# EAGLE design ELEKTRA-PMIC v0.2-Half frame shield for astellated edges adjacent-35X22.86-0.8 (EAGLE 9.6.2)

## Sheet 1 of 2
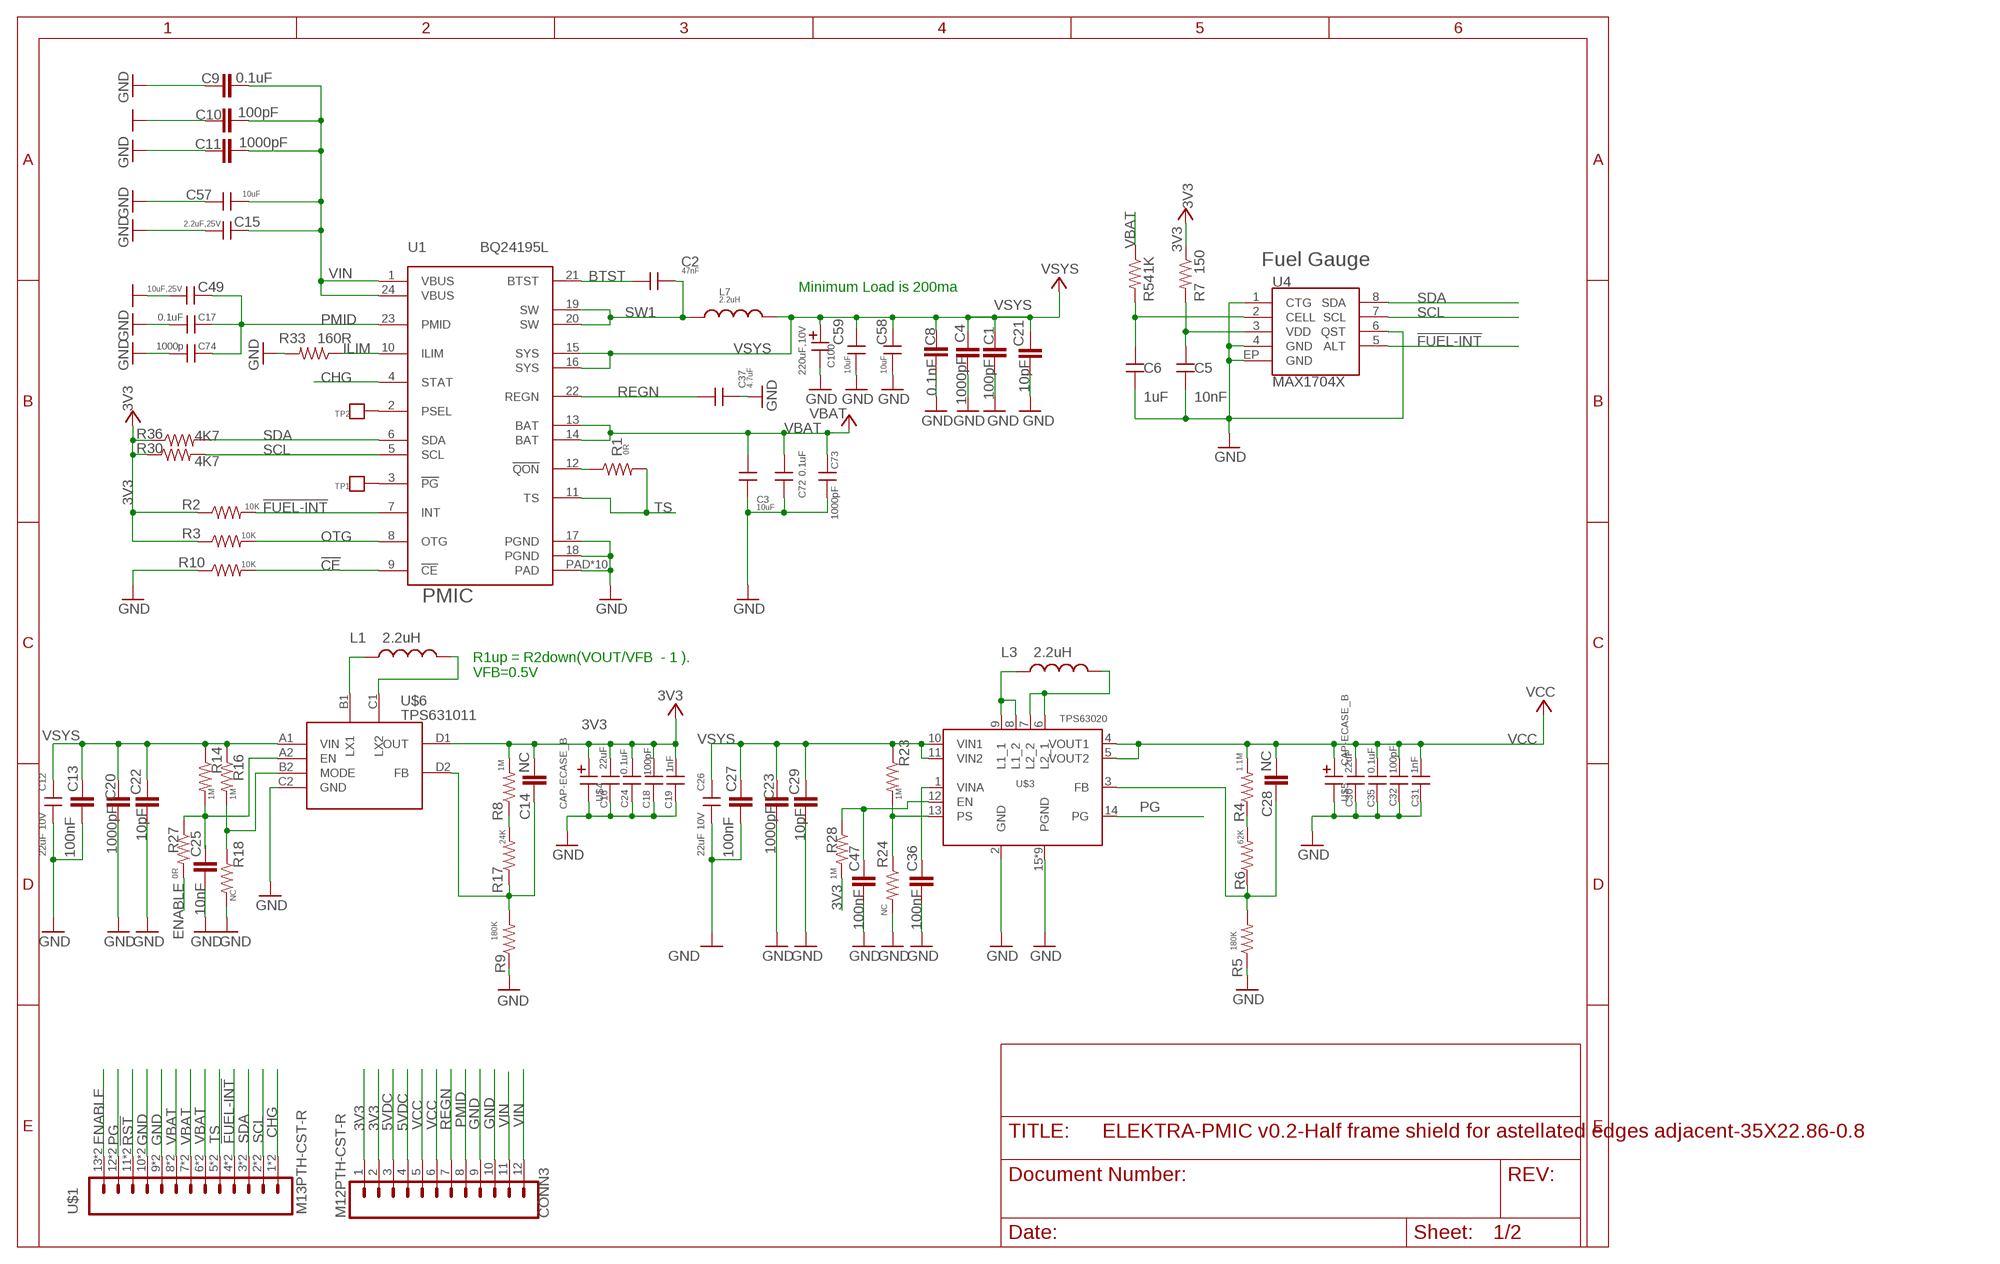
[diagram p0: schematic, sheet 1]

### Parts
C1  100pF  CAP_1  [C0402_B]
C2  47nF  CAP0402  [C-0402]
C3  10uF  CAPC0603  [C0603]
C4  1000pF  CAP_1  [C0402_B]
C5  10nF  CAP0402A  [C0402]
C6  1uF  CAP0402A  [C0402]
C8  0.1nF  CAP_1  [C0402_B]
C9  0.1uF  CAP_1  [C0402_B]
C10  100pF  CAP_1  [C0402_B]
C11  1000pF  CAP_1  [C0402_B]
C12  22uF 10V  CAPC0805  [C0805]
C13  100nF  CAP_1  [C0402_B]
C14  NC  CAP_1  [C0402_B]
C15  2.2uF,25V  CAP0603A  [C-0603A]
C16  22uF  CAP0603A  [C-0603A]
C17  0.1uF  CAP0402A  [C0402]
C18  100pF  CAP0402A  [C0402]
C19  1nF  CAP0402A  [C0402]
C20  1000pF  CAP_1  [C0402_B]
C21  10pF  CAP_1  [C0402_B]
C22  10pF  CAP_1  [C0402_B]
C23  1000pF  CAP_1  [C0402_B]
C24  0.1uF  CAP0402A  [C0402]
C25  10nF  CAP_1  [C0402_B]
C26  22uF 10V  CAPC0805  [C0805]
C27  100nF  CAP_1  [C0402_B]
C28  NC  CAP_1  [C0402_B]
C29  10pF  CAP_1  [C0402_B]
C30  22uF  CAP0603A  [C-0603A]
C31  1nF  CAP0402A  [C0402]
C32  100pF  CAP0402A  [C0402]
C35  0.1uF  CAP0402A  [C0402]
C36  100nF  CAP_1  [C0402_B]
C37  4.7uF  CAP0402A  [C0402]
C47  100nF  CAP_1  [C0402_B]
C49  10uF,25V  CAP0603A  [C-0603A]
C57  10uF  CAP0603A  [C-0603A]
C58  10uF  CAP0603A  [C-0603A]
C59  10uF  CAP0603A  [C-0603A]
C72  0.1uF  CAP0402  [C-0402]
C73  1000pF  CAP0402  [C-0402]
C74  1000p  CAP0402  [C-0402]
C100  220uF,10V  CAP-ECASE_B  [CASE-B]
CONN3  M12PTH-CST-R  [1X12-CASTELLATED]
L1  2.2uH  INDUCTOR-SPARKFUNVLS3012ET-4R7M  [INDUCTOR-VLS-E]
L3  2.2uH  INDUCTOR-SPARKFUNVLS3012ET-4R7M  [INDUCTOR-VLS-E]
L7  2.2uH  INDUCTORI  [INDUCTOR-4040]
R1  0R  R-US_  [R0402_B]
R2  10K  R-US_  [R0402_B]
R3  10K  R-US_  [R0402_B]
R4  1.1M  R-US_  [R0402_B]
R5  180K  R-US_  [R0402_B]
R6  62K  R-US_  [R0402_B]
R7  150  R-US_  [R0402_B]
R8  1M  R-US_  [R0402_B]
R9  180K  R-US_  [R0402_B]
R10  10K  R-US_  [R0402_B]
R14  1M  R-US_  [R0402_B]
R16  1M  R-US_  [R0402_B]
R17  24K  R-US_  [R0402_B]
R18  NC  R-US_  [R0402_B]
R23  1M  R-US_  [R0402_B]
R24  NC  R-US_  [R0402_B]
R27  0R  R-US_  [R0402_B]
R28  1M  R-US_  [R0402_B]
R30  4K7  R-US_  [R0402_B]
R33  160R  R-US_  [R0402_B]
R36  4K7  R-US_  [R0402_B]
R54  1K  R-US_  [R0402_B]
TP1  TP  [TP0.7MM]
TP2  TP  [TP0.7MM]
U1  BQ24195L  BQ24298RTWR  [QFN24]
U4  MAX1704X  [TDFN-8]
U$1  M13PTH-CST-R  [1X13-CASTELLATED]
U$3  TPS63020  [TPS63020]
U$4  CAP-ECASE_B  [CASE-B]
U$5  CAP-ECASE_B  [CASE-B]
U$6  TPS631011  TPS631010  [DSBGA]

### Nets
3V3: C14.2 C16.1 C18.1 C19.1 C24.1 CONN3.1 CONN3.2 R2.1 R3.1 R7.1 R8.2 R28.2 R30.1 R36.1 U$4.P$1 U$6.D1(OUT)
5VDC: CONN3.3 CONN3.4
!CE: R10.2 U1.9(!CE)
!FUEL-INT: R2.2 U1.7(INT) U4.5(ALT) U$1.4 U$1.@4
!RST: U$1.11 U$1.@11
BTST: C2.1 U1.21(BTST)
CHG: U1.4(STAT) U$1.1 U$1.@1
ENABLE: R27.2 U$1.13 U$1.@13
GND: C1.1 C3.2 C4.1 C5.2 C6.2 C8.1 C9.1 C10.1 C11.1 C12.2 C13.1 C15.2 C16.2 C17.1 C18.2 C19.2 C20.1 C21.1 C22.1 C23.1 C24.2 C25.1 C26.2 C27.1 C29.1 C30.2 C31.2 C32.2 C35.2 C36.1 C37.2 C47.1 C49.2 C57.2 C58.2 C59.2 C72.2 C73.2 C74.1 C100.P$2 CONN3.9 CONN3.10 R5.1 R9.1 R10.1 R18.2 R24.2 R33.2 U1.17(PGND) U1.18(PGND) U1.PAD U1.PAD@1(PAD) U1.PAD@2(PAD) U1.PAD@3(PAD) U1.PAD@4(PAD) U1.PAD@5(PAD) U1.PAD@6(PAD) U1.PAD@7(PAD) U1.PAD@8(PAD) U1.PAD@9(PAD) U4.1(CTG) U4.4(GND) U4.6(QST) U4.EP(GND) U$1.9 U$1.10 U$1.@9 U$1.@10 U$3.2(GND) U$3.15(PGND) U$3.16(PGND) U$3.17(PGND) U$3.18(PGND) U$3.19(PGND) U$3.20(PGND) U$3.21(PGND) U$3.22(PGND) U$3.23(PGND) U$4.P$2 U$5.P$2 U$6.C2(GND)
ILIM: R33.1 U1.10(ILIM)
N$1: R1.1 U1.12(!QON)
N$4: TP1.P$1 U1.3(!PG)
N$5: C14.1 R9.2 R17.1 U$6.D2(FB)
N$6: C28.1 R5.2 R6.1 U$3.3(FB)
N$7: TP2.P$1 U1.2(PSEL)
N$8: R8.1 R17.2
N$9: R4.1 R6.2
N$11: L3.P$1 U$3.8(L1_2) U$3.9(L1_1)
N$12: L1.P$1 U$6.B1(LX1)
N$14: C25.2 R14.2 R27.1 U$6.A2(EN)
N$15: R16.2 R18.1 U$6.B2(MODE)
N$16: L3.P$2 U$3.6(L2_1) U$3.7(L2_2)
N$17: L1.P$2 U$6.C1(LX2)
N$19: C36.2 U$3.1(VINA)
N$21: C47.2 R28.1 U$3.12(EN)
N$22: R23.2 R24.1 U$3.13(PS)
N$48: C5.1 R7.2 U4.3(VDD)
N$49: C6.1 R54.2 U4.2(CELL)
OTG: R3.2 U1.8(OTG)
PG: U$1.12 U$1.@12 U$3.14(PG)
PMID: C17.2 C49.1 C74.2 CONN3.8 U1.23(PMID)
REGN: C37.1 CONN3.7 U1.22(REGN)
SCL: R30.2 U1.5(SCL) U4.7(SCL) U$1.2 U$1.@2
SDA: R36.2 U1.6(SDA) U4.8(SDA) U$1.3 U$1.@3
SW1: C2.2 L7.P$1 U1.19(SW) U1.20(SW)
TS: R1.2 U1.11(TS) U$1.5 U$1.@5
VBAT: C3.1 C72.1 C73.1 R54.1 U1.13(BAT) U1.14(BAT) U$1.6 U$1.7 U$1.8 U$1.@6 U$1.@7 U$1.@8
VCC: C28.2 C30.1 C31.1 C32.1 C35.1 CONN3.5 CONN3.6 R4.2 U$3.4(VOUT1) U$3.5(VOUT2) U$5.P$1
VIN: C9.2 C10.2 C11.2 C15.1 C57.1 CONN3.11 CONN3.12 U1.1(VBUS) U1.24(VBUS)
VSYS: C1.2 C4.2 C8.2 C12.1 C13.2 C20.2 C21.2 C22.2 C23.2 C26.1 C27.2 C29.2 C58.1 C59.1 C100.P$1 L7.P$2 R14.1 R16.1 R23.1 U1.15(SYS) U1.16(SYS) U$3.10(VIN1) U$3.11(VIN2) U$6.A1(VIN)

### Notes on the sheet
- Fuel Gauge
- Minimum Load is 200ma
- PMIC
- R1up = R2down(VOUT/VFB  - 1 ).
  VFB=0.5V

## Sheet 2 of 2

## Library data of the parts
C1 = Particle:CAP_1; ITEM_NAME: CAP CER 100pF 50V X7R 0402 10%; ITEM_NUMBER: PT-200138
C2 = particle SZ:CAP: CAP; ITEM_NAME: CAP CER 0.1uF 16V X7R 0402 10%; ITEM_NUMBER: PT-200005
C3 C37 C58 C59 = particle SZ:CAP: CAP; ITEM_NAME: CAP CER 10uF 6.3V X5R 0603 10% Low ESR<70mohms; ITEM_NUMBER: PT-200209
C4 C20 C23 = Particle:CAP_1; ITEM_NAME: CAP CER 1000PF 50V X7R 0402 10%
C5 = particle SZ:CAP: CAP; ITEM_NAME: CAP CER 10nF 16V X5R 0402 10%; ITEM_NUMBER: PT-200136
C6 = particle SZ:CAP: CAP; ITEM_NAME: CAP CER X5R 1uF 0402 10V ±10% ROHS; ITEM_NUMBER: PT-200695
C8 C13 C27 = Particle:CAP_1; ITEM_NAME: CAP CER 0.1UF 16V X7R 0402 10%; ITEM_NUMBER: PT-200649
C9 = Particle:CAP_1; ITEM_NAME: CAP CER 0.1UF 25V X7R 0402 20%; ITEM_NUMBER: PT-200690
C10 = Particle:CAP_1; ITEM_NAME: CAP CER 100PF 1% 50V C0G/NP0 0402; ITEM_NUMBER: 120-00051
C11 = Particle:CAP_1; ITEM_NAME: CAP CER 1000PF 50V X7R 0402 10%; ITEM_NUMBER: PT-200631
C12 C26 = particle SZ:CAP: CAP; ITEM_NAME: CAP CER 0.1UF 16V X7R 0402 10%; ITEM_NUMBER: 120-00060
C14 C25 C28 C36 C47 = Particle:CAP_1
C15 C49 C57 = particle SZ:CAP: CAP; ITEM_NAME: CAP CER 100PF 50V C0G/NP0 0603 5%; ITEM_NUMBER: PT-200458
C16 C30 = particle SZ:CAP: CAP; ITEM_NAME: CAP CER 22UF 10V X5R 0603 20%; ITEM_NUMBER: 120-00061
C17 = RedBear:CAP: CAP; ITEM_NAME: CAP CER 0.1UF 25V X7R 0402 20%; ITEM_NUMBER: PT-200690
C18 C32 = particle SZ:CAP: CAP; ITEM_NAME: 100pF 50V X7R 0402 10%; ITEM_NUMBER: PT-200138
C19 C31 C73 = particle SZ:CAP: CAP; ITEM_NAME: 1000PF 50V X7R 0402 10%; ITEM_NUMBER: PT-200631
C21 C22 C29 = Particle:CAP_1; ITEM_NAME: CAP CER 10PF 5% 50V C0G/NP0 0402; ITEM_NUMBER: 120-00038
C24 C35 = particle SZ:CAP: CAP; ITEM_NAME: 0.1UF 16V X7R 0402 10%; ITEM_NUMBER: PT-200649
C72 = particle SZ:CAP: CAP; ITEM_NAME: CAP CER 0.1UF 16V X7R 0402 10%; ITEM_NUMBER: PT-200649
C74 = particle SZ:CAP: CAP; ITEM_NAME: CAP CER 1000PF 50V X7R 0402 10%; ITEM_NUMBER: PT-200631
C100 U$4 U$5 = particle SZ:CAP-E
CONN3 = Particle:M12: Header 12 Standard 12-pin 0.1" header. Use with straight break away headers (SKU : PRT-00116), right angle break away headers (PRT-00553), swiss pins (PRT-00743), machine pins (PRT-00117), and female headers (PRT-00115).
L1 L3 = Particle:INDUCTOR-SPARKFUN: Inductors Basic Inductor/Choke - 0603 and 1206. Footprints are not proven and vary greatly between part numbers. SRN6045- 33uH, 20% 1.4A
L7 = Particle:INDUCTOR; ITEM_NAME: FIXED IND 1UH 5.8A 26 MOHM SMD 4020; ITEM_NUMBER: 155-00005
R1 = Spark:R-US_: 0402 Resistor; ITEM_NAME: RES SMD 0R OHM 5% 1/16W 0402; ITEM_NUMBER: PT-200624
R2 R3 R10 = Spark:R-US_: 0402 Resistor; ITEM_NAME: 10K OHM 5% 1/16W 0402; ITEM_NUMBER: PT-200004
R4-R6 R9 R18 R24 R27 R28 = Spark:R-US_: 0402 Resistor
R7 R33 = Particle:R-US_: 0402 Resistor
R8 R14 R16 R23 = Spark:R-US_: 0402 Resistor; ITEM_NAME: RES SMD 1M OHM 1% 1/16W 0402; ITEM_NUMBER: PT-201084
R17 = Spark:R-US_: 0402 Resistor; ITEM_NAME: RES SMD 24K OHM 1% 1/16W 0402; ITEM_NUMBER: PT-201025
R30 R36 = Particle:R-US_: 0402 Resistor; ITEM_NAME: RES SMD 4K7 OHM 5% 1/16W 0402; ITEM_NUMBER: PT-200230
R54 = Particle:R-US_: 0402 Resistor; ITEM_NAME: RES SMD 1K OHM 5% 1/16W 0402; ITEM_NUMBER: PT-200002
TP1 TP2 = Asset Tracker SoM v1.0b:TP
U1 = electron:BQ24298RTWR: Bq24298 I2C Controlled 3A Single Cell USB Charger with Narrow VDC Power Path Management and Adjustable Voltage USB OTG; ITEM_NAME: IC BATT CHG LI-ION 1CELL 24VQFN 2.5A CHG CURRENT; ITEM_NUMBER: 150-00013
U4 = SparkFun-PowerIC:MAX1704X: MAX17043/MAX17044: Battery Fuel Guage (43 is 1cell, 44 is 2cell); ITEM_NAME: IC 2-WIRE FG MODEL GAUGE LO BATT; ITEM_NUMBER: PT-200141
U$1 = Particle:M13PTH-CST-R
U$3 = particle SZ:TPS63020
U$6 = particle SZ:TPS631010

## Net classes
0 default: width 0.152 mm, drill 0.203 mm, clearance 0.152 mm
1 power: width 0.254 mm, drill 0.203 mm, clearance 0.203 mm
3 BAT: drill 0.203 mm, clearance 0.203 mm
4 3V3: width 0.305 mm, drill 0.203 mm, clearance 0.508 mm
6 +3V3: width 0.203 mm, drill 0.203 mm, clearance 0.152 mm

## Board
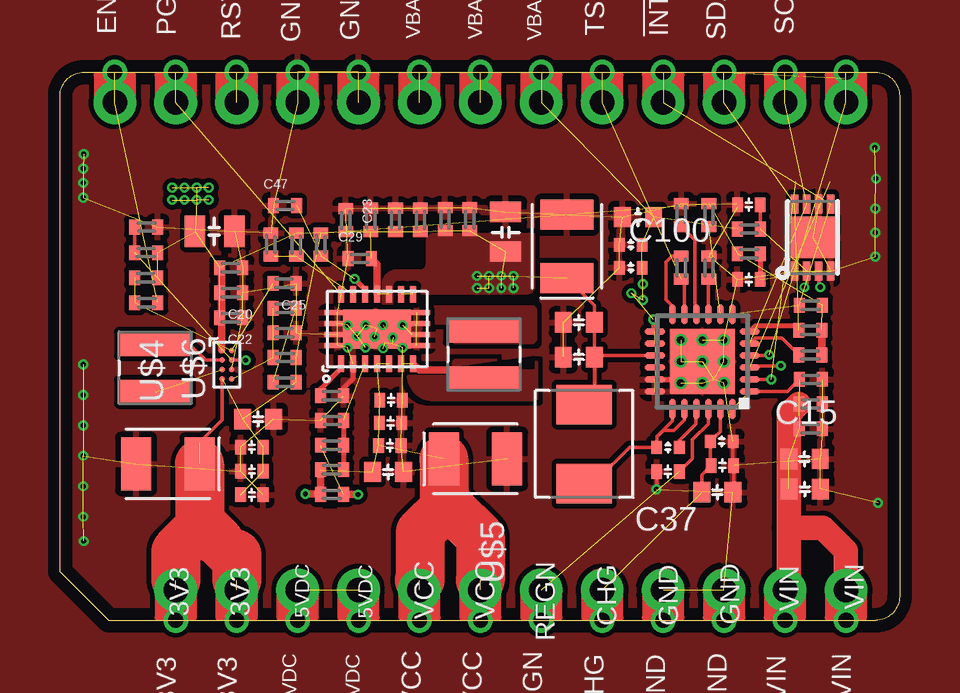
[diagram p1: board, top side]
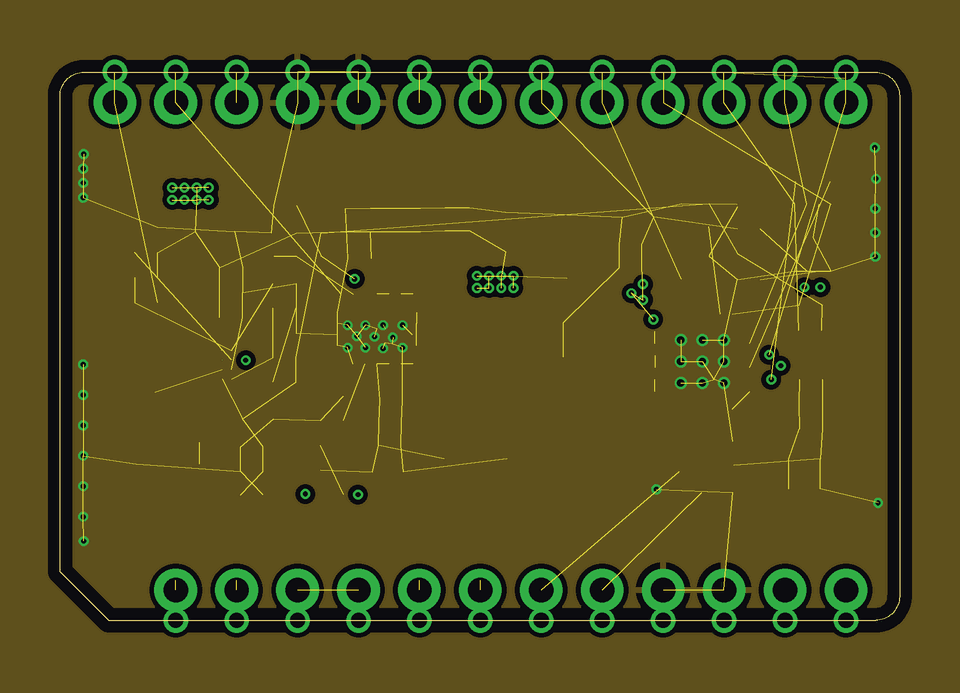
[diagram p2: board, inner layer Route2]
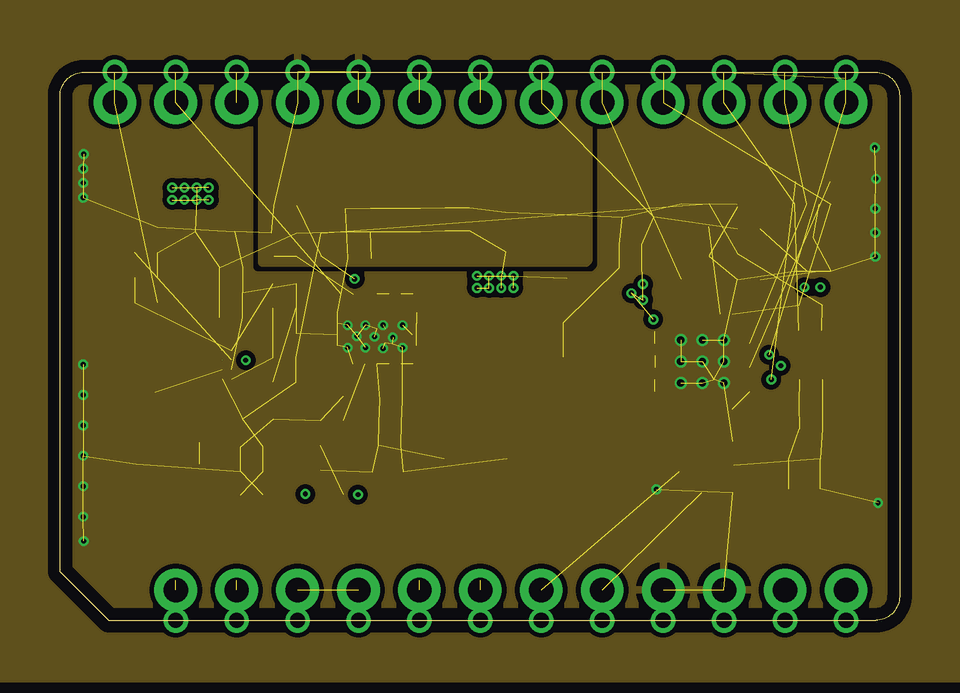
[diagram p3: board, inner layer Route15]
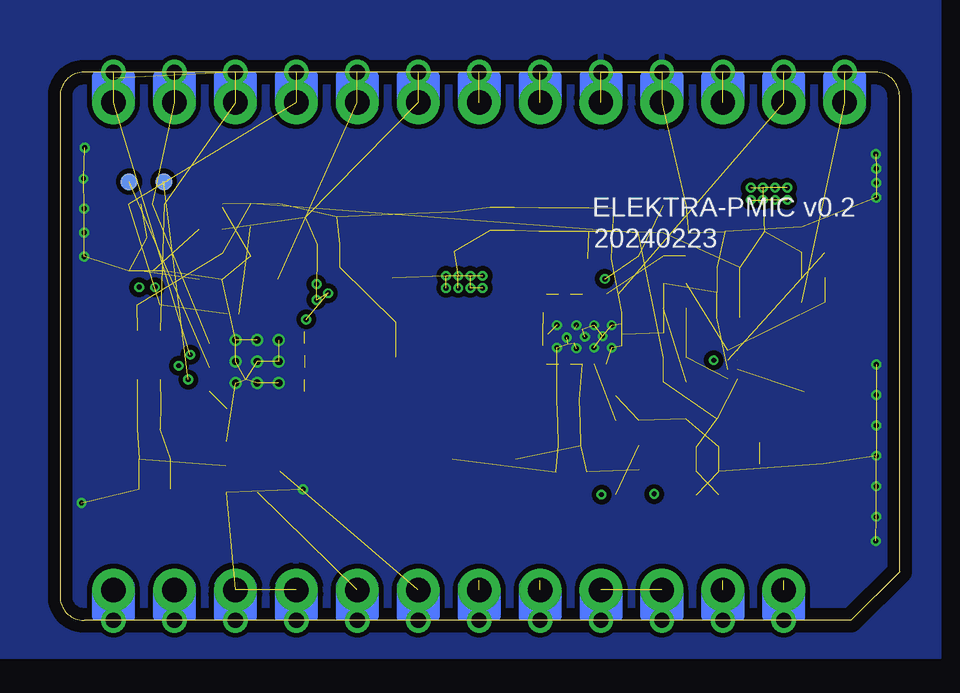
[diagram p4: board, bottom side, seen from below]

Size 35 x 22.86 mm. Coordinates in mm from the lower left corner, seen from the top.
Outline: 2.03,0 34,0 arc90 35,1 35,21.86 arc90 34,22.86 1,22.86 arc90 0,21.86 0,2.03 2.03,0
Copper layers (1+2*15+16): Top 0.035mm / dielectric 1.5mm / Route2 0.035mm / dielectric 0.15mm / Route15 0.035mm / dielectric 0.2mm / Bottom 0.035mm
Design rules "default *": minimum track width 4mil, minimum drill 8mil, track to track 8mil, track to pad 6mil, pad to pad 6mil, via to via 6mil, smd to smd 6mil, copper to edge 20mil, drill to drill 6mil, minimum pad ring 4mil, minimum via ring 4mil, stop-mask expansion 4mil, vias tented up to drill 16mil, thermal gap 10mil

### Footprints (pad centres in the part's own frame; a part is rotated, then mirrored left to right if it is on the bottom)
C0402_B = smd 0.457 x 0.61: 1 -0.483,0; 2 0.483,0
C-0402 = smd 0.45 x 0.55: 1 -0.47,0; 2 0.47,0
C0603 = smd 0.7 x 0.85: 1 -0.65,0; 2 0.65,0
C0402 = smd 0.45 x 0.6: 1 -0.47,0; 2 0.47,0
C0805 = smd 0.85 x 1.3: 1 -0.8,0; 2 0.85,0
C-0603A = smd 0.7 x 0.85: 1 -0.65,0; 2 0.65,0
CASE-B = smd 2.2 x 1.25: P$1 0,-1.32; P$2 0,1.32
1X12-CASTELLATED = drill 1.016 pad 1.778: 1 0,-13.97; 2 0,-11.43; 3 0,-8.89; 4 0,-6.35; 5 0,-3.81; 6 0,-1.27; 7 0,1.27; 8 0,3.81; 9 0,6.35; 10 0,8.89; 11 0,11.43; 12 0,13.97 | drill 0.635 pad 1.016: @1 1.27,-13.97; @2 1.27,-11.43; @3 1.27,-8.89; @4 1.27,-6.35; @5 1.27,-3.81; @6 1.27,-1.27; @7 1.27,1.27; @8 1.27,3.81; @9 1.27,6.35; @10 1.27,8.89; @11 1.27,11.43; @12 1.27,13.97
INDUCTOR-VLS-E = smd 1 x 3: P$1 -1,0; P$2 1,0
INDUCTOR-4040 = smd 1.65 x 2.3: P$1 -1.65,0; P$2 1.65,0
R0402_B = smd 0.457 x 0.61: 1 -0.483,0; 2 0.483,0
TP0.7MM = smd 0.7 x 0.7: P$1 0,0
QFN24 = smd 0.85 x 0.28: 1 -1.975,1.25; 2 -1.975,0.75; 3 -1.975,0.25; 4 -1.975,-0.25; 5 -1.975,-0.75; 6 -1.975,-1.25; 13 1.975,-1.25; 14 1.975,-0.75; 15 1.975,-0.25; 16 1.975,0.25; 17 1.975,0.75; 18 1.975,1.25 | smd 0.28 x 0.85: 7 -1.25,-1.975; 8 -0.75,-1.975; 9 -0.25,-1.975; 10 0.25,-1.975; 11 0.75,-1.975; 12 1.25,-1.975; 19 1.25,1.975; 20 0.75,1.975; 21 0.25,1.975; 22 -0.25,1.975; 23 -0.75,1.975; 24 -1.25,1.975 | smd 2.7 x 2.7: PAD 0,0 | drill 0.3 pad 0.406: PAD@1 -0.9,0.9; PAD@2 0,0.9; PAD@3 0.9,0.9; PAD@4 -0.9,0; PAD@5 0,0; PAD@6 0.9,0; PAD@7 -0.9,-0.9; PAD@8 0,-0.9; PAD@9 0.9,-0.9
TDFN-8 = smd 0.8 x 0.3: 1 -1.4,0.75; 2 -1.4,0.25; 3 -1.4,-0.25; 4 -1.4,-0.75; 5 1.4,-0.75; 6 1.4,-0.25; 7 1.4,0.25; 8 1.4,0.75 | smd 1.73 x 1.88: EP 0,0
1X13-CASTELLATED = drill 1.016 pad 1.778: 1 0,-15.24; 2 0,-12.7; 3 0,-10.16; 4 0,-7.62; 5 0,-5.08; 6 0,-2.54; 7 0,0; 8 0,2.54; 9 0,5.08; 10 0,7.62; 11 0,10.16; 12 0,12.7; 13 0,15.24 | drill 0.635 pad 1.016: @1 1.27,-15.24; @2 1.27,-12.7; @3 1.27,-10.16; @4 1.27,-7.62; @5 1.27,-5.08; @6 1.27,-2.54; @7 1.27,0; @8 1.27,2.54; @9 1.27,5.08; @10 1.27,7.62; @11 1.27,10.16; @12 1.27,12.7; @13 1.27,15.24
TPS63020 = smd 0.25 x 0.7: 1 -1.5,-1.45; 2 -1,-1.45; 3 -0.5,-1.45; 4 0,-1.45; 5 0.5,-1.45; 6 1,-1.45; 7 1.5,-1.45; 8 1.5,1.45; 9 1,1.45; 10 0.5,1.45; 11 0,1.45; 12 -0.5,1.45; 13 -1,1.45; 14 -1.5,1.45 | smd 1.1 x 0.2: 15 -1.65,0.69; 16 -1.65,0.23; 17 -1.65,-0.23; 18 -1.65,-0.69; 19 1.65,-0.69; 20 1.65,-0.23; 21 1.65,0.23; 22 1.65,0.69 | smd 2.85 x 1.58: 23 0,0
DSBGA = smd 0.23 x 0.23: A1 -0.2,0.6; A2 0.2,0.6; B1 -0.2,0.2; B2 0.2,0.2; C1 -0.2,-0.2; C2 0.2,-0.2; D1 -0.2,-0.6; D2 0.2,-0.6

### Placement (x,y rotation side)
C1  15.03,16.7 270 top
C2  25.35,7.21 180 top
C3  24.1,16.82 180 top
C4  16.06,16.73 270 top
C5  28.72,14.21 180 top
C6  28.72,17.33 180 top
C8  17.08,16.73 270 top
C9  31.3,7.99 180 top
C10  31.3,10.05 180 top
C11  31.29,9.03 180 top
C12  6.43,16.22 0 top
C13  7.14,14.7 180 top
C14  9.36,10.96 0 top
C15  31.04,6.73 0 top
C16  8.26,8.39 0 top
C17  27.61,6.46 180 top
C18  8,6.22 180 top
C19  8,7.23 180 top
C20  7.14,13.67 180 top
C21  13.99,16.7 270 top
C22  7.14,12.62 180 top
C23  11.91,16.69 270 top
C24  8,5.24 0 top
C25  9.36,14.05 180 top
C26  18.58,16.18 90 top
C27  12.95,16.7 270 top
C28  11.34,6.28 180 top
C29  12.5,15.09 0 top
C30  13.68,6.19 0 top
C31  13.8,9.18 0 top
C32  13.78,8.23 0 top
C35  13.75,7.29 0 top
C36  11.34,9.37 180 top
C37  25.35,6.2 180 top
C47  9.38,17.29 0 top
C49  27.41,5.35 0 top
C57  31.04,5.47 0 top
C58  21.63,10.98 180 top
C59  21.63,12.43 180 top
C72  23.8,14.7 180 top
C73  23.8,15.66 180 top
C74  27.59,7.47 180 top
C100  21.13,15.6 0 top
CONN3  18.8,1.27 270 top
L1  3.96,10.52 270 top
L3  17.67,11.09 270 top
L7  21.86,7.35 90 top
R1  25.9,14.71 270 top
R2  31.3,13.14 180 top
R3  27.05,16.9 270 top
R4  11.34,5.25 180 top
R5  11.34,8.34 0 top
R6  11.34,7.3 180 top
R7  28.72,15.29 0 top
R8  9.36,9.93 0 top
R9  9.36,11.99 180 top
R10  27.05,14.71 270 top
R14  3.59,14.29 180 top
R16  3.6,15.33 180 top
R17  9.36,13.01 0 top
R18  3.6,16.4 0 top
R23  9.85,15.66 270 top
R24  8.8,15.66 90 top
R27  3.6,13.24 0 top
R28  10.88,15.66 90 top
R30  31.28,11.07 180 top
R33  25.9,16.9 90 top
R36  31.28,12.09 180 top
R54  28.72,16.32 0 top
TP1  32.12,18.29 180 bottom
TP2  30.68,18.29 180 bottom
U1  26.78,10.79 180 top
U4  31.38,15.96 90 top
U$1  17.53,21.59 90 top
U$3  13.22,12.15 0 top
U$4  4.5,6.53 90 top
U$5  17.32,6.73 270 top
U$6  6.95,10.66 0 top

### Tracks (layer width: path | path; a pad name or v marks a point on that pad's centre or on a via)
3V3  (14 unrouted)
  Top 0.152: U$6.D1 6.75,8.36 5.82,7.42
  Top 0.203: R36.1 R30.1
  Top 0.305: R30.1 31.77,11.81
  Top 2.032: U$4.P$1 5.82,4.14 5.84,4.12 | 5.84,4.12 5.84,3.91 4.83,2.9 4.83,1.68 | 5.84,4.12 6.66,3.3 6.66,3.23 7.09,2.79 7.32,2.79 7.37,2.74 7.37,1.68
5VDC  (1 unrouted)
!CE
  Top 0.152: U1.9 27.03,14.21 R10.2
!FUEL-INT  (4 unrouted)
!RST  (1 unrouted)
BTST
  Top 0.152: C2.1 25.82,7.49 26.52,8.19 26.52,8.81 U1.21
CHG  (via drill 0.2 pad 0.41)  (2 unrouted)
  Top 0.152: v29.57,11.07 29.54,11.04 U1.4
ENABLE  (2 unrouted)
GND  (via drill 0.2 pad 0.41)  (104 unrouted)
  Top 0.152: U$3.21 14.7,12.38 13.85,11.52 | U$3.22 14.75,12.84 | 13.56,12.15 U$3.23 13.55,11.56 | U$3.20 14.68,11.92 | C74.1 28.06,6.48 C17.1 28.08,5.37 C49.2 | C37.2 24.88,5.47 v24.87,5.46
  Top 0.203: U$3.2 12.22,10.1 11.83,9.7 C36.1 | U1.17 27.25,10.04
  Top 0.305: 28.25,17.22 C6.2 28.22,17.36
  other vias: 12,12.31 12.73,12.31 13.47,12.31 14.28,12.31 12.38,11.85 13.11,11.82 13.88,11.8 12,11.37 12.73,11.37 13.47,11.34 14.28,11.37 0.99,19.44 0.97,18.83 0.97,18.24 0.97,17.63 0.97,10.67 0.97,9.4 0.97,8.13 0.97,6.86 0.97,5.59 0.97,4.32 0.99,3.31 34.11,4.9 33.97,19.71 34.02,18.41 33.99,17.17 33.99,16.17 33.99,15.17
  pour Bottom (rank 3): -1.7,29.34 47.42,29.34 47.42,-1.55 -1.7,-1.55
  pour Top (rank 3): -4.7,31.57 42.57,31.57 42.57,-4.98 -4.7,-4.98
  pour Route2: -3.73,30.63 44.27,30.63 44.27,-3.23 -3.73,-3.23
  cutout Top: 19.74,10.99 19.74,10.53 16.44,10.53
  pour Route15 (rank 3): -2.9,29.97 45.82,29.97 45.82,-2.44 -2.9,-2.44
  cutout Top: 10.98,6.7 10.98,4.71 11.51,4.71 11.51,6.7
ILIM
  Top 0.152: R33.1 26.47,15.85 26.47,12.83 U1.10
  Top 0.203: U1.10 26.57,12.77
N$1
  Top 0.152: R1.1 25.51,15.19 25.26,14.95 25.26,13.37 25.53,13.11 U1.12
  Top 0.203: 25.53,13 U1.12
N$4  (via drill 0.2 pad 0.41)  (1 unrouted)
  Top 0.152: v30.05,10.62 29,10.62 28.93,10.54 U1.3
N$5  (3 unrouted)
N$6  (1 unrouted)
  Top 0.203: 11.83,8.19 R5.2 R6.1 C28.1
N$7  (via drill 0.2 pad 0.41)  (1 unrouted)
  Top 0.152: U1.2 v29.65,10.04 | v29.65,10.04
N$8  (1 unrouted)
N$9  (via drill 0.2 pad 0.41)  (1 unrouted)
  Top 0.305: v12.43,5.24 12.42,5.25 R4.1
N$11  (1 unrouted)
  pour Top (no thermals): 14.59,13.1 19.67,13.1 arc-90 19.82,12.94 19.82,11.72 arc-90 19.67,11.57 16.52,11.57 arc-90 16.37,11.72 16.37,12.28 arc90 16.26,12.38 14.59,12.38 arc-90 14.54,12.44 14.54,13.05 arc-90
N$12  (1 unrouted)
  Top 0.152: L1.P$1 5.39,11.53 6.07,10.85 U$6.B1
N$14  (3 unrouted)
N$15  (via drill 0.2 pad 0.41)  (1 unrouted)
  Top 0.152: R18.1 R16.2 | U$6.B2 7.73,10.86 v7.75,10.85
N$16  (1 unrouted)
  Top 0.305: L3.P$2 17.33,10.44 14.98,10.44 U$3.7
  pour Top (no thermals): 14.54,10.2 16.16,10.2 arc90 16.42,10.45 16.42,10.76 arc-90 16.52,10.86 19.72,10.86 arc-90 19.87,10.71 19.87,9.29 arc-90 19.77,9.18 15.55,9.18 arc-90
N$17  (1 unrouted)
N$19
  Top 0.203: U$3.1 11.72,10.52 10.86,9.65 C36.2
N$21  (via drill 0.2)  (2 unrouted)
  Top 0.203: v12.28,14.24 12.72,13.8 U$3.12
N$22  (2 unrouted)
  Top 0.203: R24.1 8.93,15.18
N$48  (via drill 0.2 pad 0.41)  (1 unrouted)
  Top 0.152: U4.3 31.62,13.97 v31.7,13.89
  Top 0.203: R7.2 29.2,14.23 C5.1
N$49  (via drill 0.2 pad 0.41)  (1 unrouted)
  Top 0.152: C6.1 29.2,17.32 R54.2 | U4.2 31.12,13.98 v31.04,13.89
OTG  (1 unrouted)
PG  (2 unrouted)
PMID  (1 unrouted)
  Top 0.152: U1.23 27.53,7.88 C74.2 27.12,6.48 C17.2 26.76,6.07 C49.1
REGN  (1 unrouted)
  Top 0.152: C37.1 26.37,6.76 26.37,7.54 27.03,8.2 U1.22
SCL  (3 unrouted)
  Top 0.152: U1.5 28.98,11.77 30.09,11.77 R30.2
SDA  (4 unrouted)
  Top 0.203: R36.2 30.62,12.27 28.98,12.27 U1.6
  Bottom 0.203: 33.48,21.83 32.69,22.62
SW1
  Top 0.152: 24.88,7.66 C2.2 23.75,7.21 22.24,5.7 L7.P$1 | 24.88,7.66 25.53,8.31 U1.19 | U1.20 26.03,8.35 25.6,7.92 25.15,7.92 24.88,7.66
  Top 0.254: C2.2 24.91,7.21
  Top 0.305: 22.7,5.7 L7.P$1
TS  (2 unrouted)
  Top 0.152: U1.11 26.03,14.1 R1.2
  Top 0.203: 26.03,12.87 U1.11
VBAT  (via drill 0.2 pad 0.41)  (14 unrouted)
  Top 0.305: R54.1 28.24,16.43 | v24.74,12.55 24.74,12.52 24.8,12.46 U1.13
  other vias: 24.31,14.02 23.82,13.64 24.31,13.36
VCC  (via drill 0.2 pad 0.41)  (9 unrouted)
  Top 0.305: C28.2 R4.2 10.84,5.27 v10.23,5.27
  Top 2.032: U$5.P$1 16,4.67 | 14.99,1.68 15.01,1.7 15.01,3.68 16,4.67 | 16,4.67 16.33,4.67 17.53,3.48 17.53,1.68
VIN  (5 unrouted)
  Top 0.152: C10.2 30.32,9.54 U1.1
  Top 1.016: C11.2 30.38,8.59 30.38,3.86 | CONN3.11 30.38,1.42 30.38,3.86 | 30.38,3.86 31.8,3.86 32.77,2.9 CONN3.12
VSYS  (via drill 0.2 pad 0.41)  (34 unrouted)
  Top 0.152: U1.15 22.47,11.04 22.3,10.87 22.3,9 L7.P$2 22.28,9.43 C58.1 C59.1 22.28,13.13 C100.P$1
  Top 0.203: L7.P$2 21.48,9.37
  Top 0.305: C13.2 6.74,14.62 6.74,11.28 | C29.2 13.22,14.85 U$3.11
  other vias: 6.2,17.53 5.69,17.53 5.19,17.53 4.68,17.53 6.2,18.04 5.69,18.04 5.19,18.04 4.68,18.04 17.38,14.37 17.89,14.37 18.4,14.37 18.91,14.37 17.38,13.86 17.89,13.86 18.4,13.86 18.91,13.86
  pour Top (no thermals): 13.47,14.01 13.47,12.49 arc90 13.57,12.38 14.18,12.38 14.18,13.4 arc-90 14.44,13.65 19.46,13.65 arc90 19.77,13.96 19.77,16.09 15.6,16.09 arc90 15.3,15.79 15.3,14.85 arc-90 15.02,14.57 14.03,14.57 arc90
  pour Route15: 8.31,21.92 8.31,14.94 arc90 8.43,14.81 21.89,14.81 arc90 22.15,15.06 22.15,21.67 arc90 21.77,22.05 8.43,22.05 arc90

### Text on the board
Top: T1
Route2: G2
Route15: P3
Bottom: B4
tPlace: EN | PG | RST | GND | GND | VBAT | VBAT | VBAT | TS | !INT | SDA | SCL | 3V3 | 3V3 | 5VDC | 5VDC | VCC | VCC | CHG | GND | GND | VIN | VIN | REGN | VIN | VIN | 3V3 | 3V3 | 5VDC | 5VDC | VCC | VCC | CHG | GND | GND | REGN
bPlace: ELEKTRA-PMIC v0.2 | 20240223
Reference: 40*27mm
tDocu: NR3015T2R2M